# Altium schematic sheet S01.SchDoc: IEEE-1394/Ethernet FPGA Controller
size 381 x 254 mm; Revision: 3.2; SheetNumber: 1; SheetTotal: 10; PageSetup: Record=PageOptions|CenterHorizontal=True|CenterVertical=True|PrintScale=1.08|XCorrection=1.00|YCorrection=1.00|PrintKind=1|BorderSize=5000000|LeftOffset=0|BottomOffset=0|Orientation=2|PaperLength=1000|PaperWidth=1000|Scale=100|PaperSource=7|PrintQuality=600|MediaType=1|DitherType=10|PrintScaleMode=1|PaperKind=Ledger|PaperIndex=3
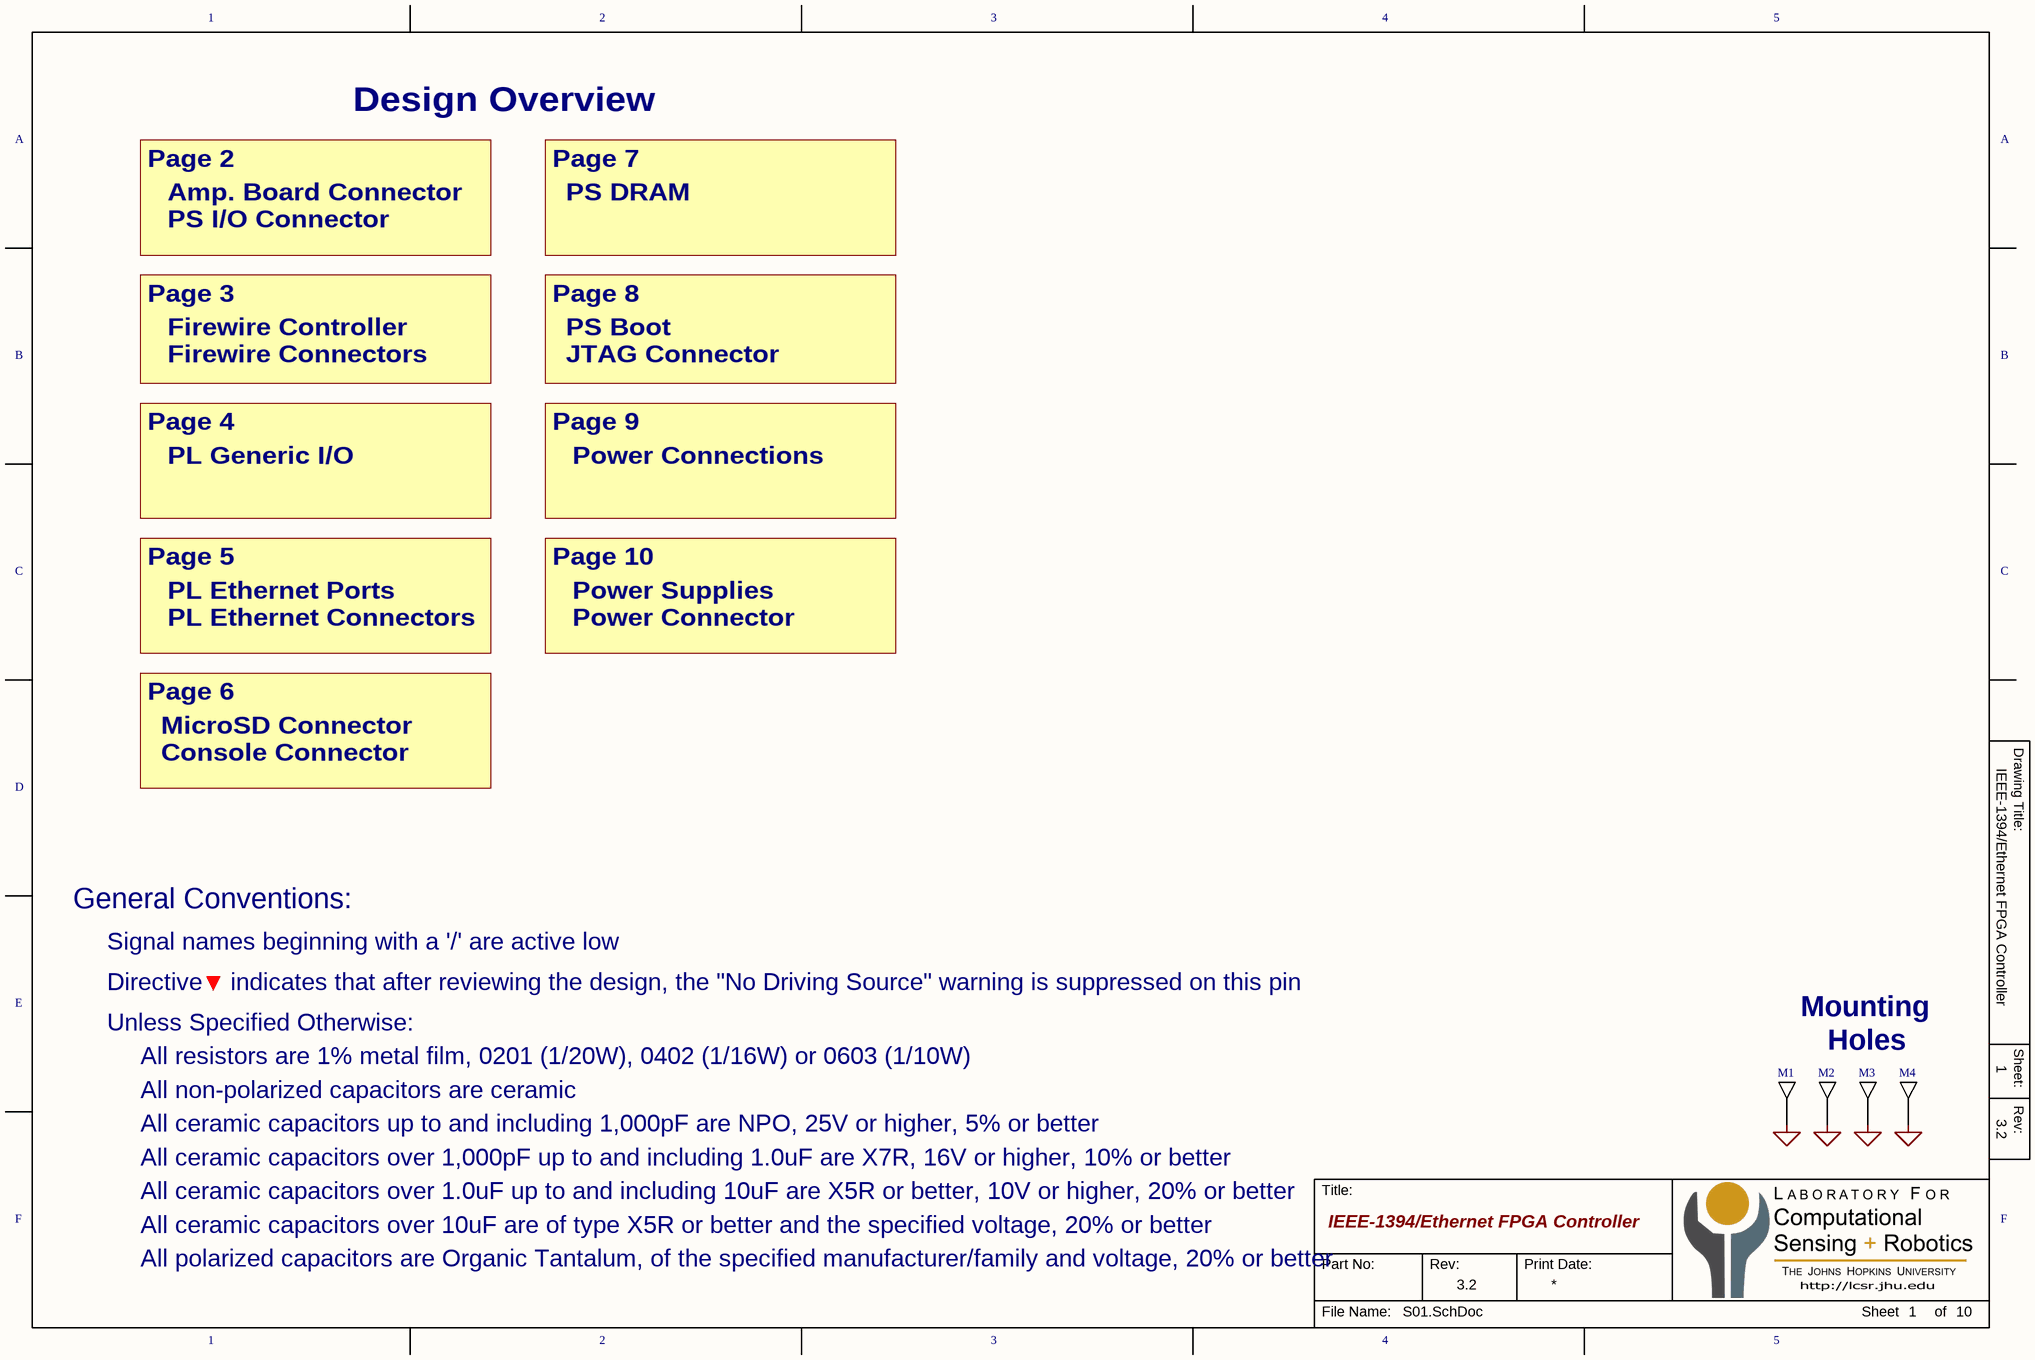
[diagram p0: S01.SchDoc]

## Parts
M1  MHOLE  [MHOLE4]  (value not drawn)  (no BOM)
M2  MHOLE  [MHOLE4]  (value not drawn)  (no BOM)
M3  MHOLE  [MHOLE4]  (value not drawn)  (no BOM)
M4  MHOLE  [MHOLE4]  (value not drawn)  (no BOM)

## Nets
GND: M1.1 M2.1 M3.1 M4.1

## Notes on the sheet
- Page 2
- Design Overview
- Page 7
- Amp. Board Connector
- PS I/O Connector
- PS DRAM
- Page 3
- Page 8
- Firewire Controller
- Firewire Connectors
- PS Boot
- JTAG Connector
- Page 4
- Page 9
- PL Generic I/O
- Power Connections
- Page 5
- Page 10
- PL Ethernet Connectors
- PL Ethernet Ports
- Power Connector
- Power Supplies
- Page 6
- Console Connector
- MicroSD Connector
- General Conventions:
- Signal names beginning with a '/' are active low
- Unless Specified Otherwise:
- Directive    indicates that after reviewing the design, the "No Driving Source" warning is suppressed on this pin
- Mounting
- All resistors are 1% metal film, 0201 (1/20W), 0402 (1/16W) or 0603 (1/10W)
- All non-polarized capacitors are ceramic
- Holes
- All ceramic capacitors up to and including 1,000pF are NPO, 25V or higher, 5% or better
- All ceramic capacitors over 1,000pF up to and including 1.0uF are X7R, 16V or higher, 10% or better
- All ceramic capacitors over 10uF are of type X5R or better and the specified voltage, 20% or better
- All ceramic capacitors over 1.0uF up to and including 10uF are X5R or better, 10V or higher, 20% or better
- All polarized capacitors are Organic Tantalum, of the specified manufacturer/family and voltage, 20% or better
- 1
- 2
- 3
- 4
- 5
- A
- B
- C
- Drawing Title:
- D
- E
- Sheet:
- Rev:
- F
- Title:
- Part No:
- Print Date:
- File Name:
- Sheet
- of

## Library data of the parts
M1-M4 = MHOLE: Mounting Hole